# Altium project Flex_design.PrjPcb
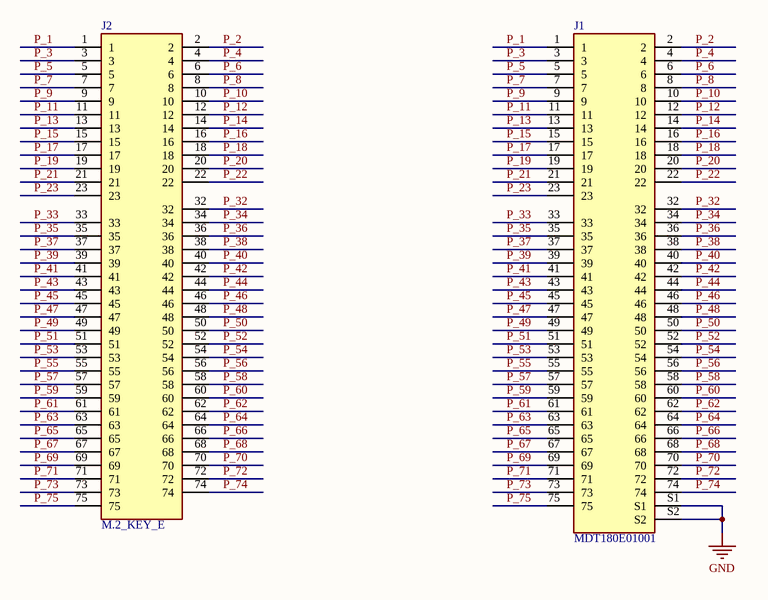
[diagram p0: Flex_design.SchDoc]
1 sheet, 2 parts. Net scope: global (net labels, ports and power ports of the same name join across sheets).
Board file: Flex_design.PcbDoc

## Sheet Flex_design.SchDoc
size A; SheetNumber: 1; SheetTotal: 1

### Parts
J1  MDT180E01001  [AMPHENOL_MDT180E01001]
J2  M.2_KEY_E  [M.2_KEY_E]

### Nets
GND: J1.S1 J1.S2
P_1: J1.1 J2.1
P_2: J1.2 J2.2
P_3: J1.3 J2.3
P_4: J1.4 J2.4
P_5: J1.5 J2.5
P_6: J1.6 J2.6
P_7: J1.7 J2.7
P_8: J1.8 J2.8
P_9: J1.9 J2.9
P_10: J1.10 J2.10
P_11: J1.11 J2.11
P_12: J1.12 J2.12
P_13: J1.13 J2.13
P_14: J1.14 J2.14
P_15: J1.15 J2.15
P_16: J1.16 J2.16
P_17: J1.17 J2.17
P_18: J1.18 J2.18
P_19: J1.19 J2.19
P_20: J1.20 J2.20
P_21: J1.21 J2.21
P_22: J1.22 J2.22
P_23: J1.23 J2.23
P_32: J1.32 J2.32
P_33: J1.33 J2.33
P_34: J1.34 J2.34
P_35: J1.35 J2.35
P_36: J1.36 J2.36
P_37: J1.37 J2.37
P_38: J1.38 J2.38
P_39: J1.39 J2.39
P_40: J1.40 J2.40
P_41: J1.41 J2.41
P_42: J1.42 J2.42
P_43: J1.43 J2.43
P_44: J1.44 J2.44
P_45: J1.45 J2.45
P_46: J1.46 J2.46
P_47: J1.47 J2.47
P_48: J1.48 J2.48
P_49: J1.49 J2.49
P_50: J1.50 J2.50
P_51: J1.51 J2.51
P_52: J1.52 J2.52
P_53: J1.53 J2.53
P_54: J1.54 J2.54
P_55: J1.55 J2.55
P_56: J1.56 J2.56
P_57: J1.57 J2.57
P_58: J1.58 J2.58
P_59: J1.59 J2.59
P_60: J1.60 J2.60
P_61: J1.61 J2.61
P_62: J1.62 J2.62
P_63: J1.63 J2.63
P_64: J1.64 J2.64
P_65: J1.65 J2.65
P_66: J1.66 J2.66
P_67: J1.67 J2.67
P_68: J1.68 J2.68
P_69: J1.69 J2.69
P_70: J1.70 J2.70
P_71: J1.71 J2.71
P_72: J1.72 J2.72
P_73: J1.73 J2.73
P_74: J1.74 J2.74
P_75: J1.75 J2.75

### Library data of the parts
J1 = MDT180E01001: PCIe M.2 Connectors, Storage and Server Connector, P=0.5mm, H=1.8mm, Key E, 30Î¼in Au Plating; MF: Amphenol; MP: MDT180E01001; Value: *; Purchase-URL: https://pricing.snapeda.com/search/part/MDT180E01001/?ref=eda; SnapEDA_Link: https://www.snapeda.com/parts/MDT180E01001/Amphenol/view-part/?ref=snap; Price: None; Package: None; Check_prices: https://www.snapeda.com/parts/MDT180E01001/Amphenol/view-part/?ref=eda; Availability: In Stock